# Altium schematic sheet Motor.SchDoc
size A3; SheetNumber: 2; SheetTotal: 5
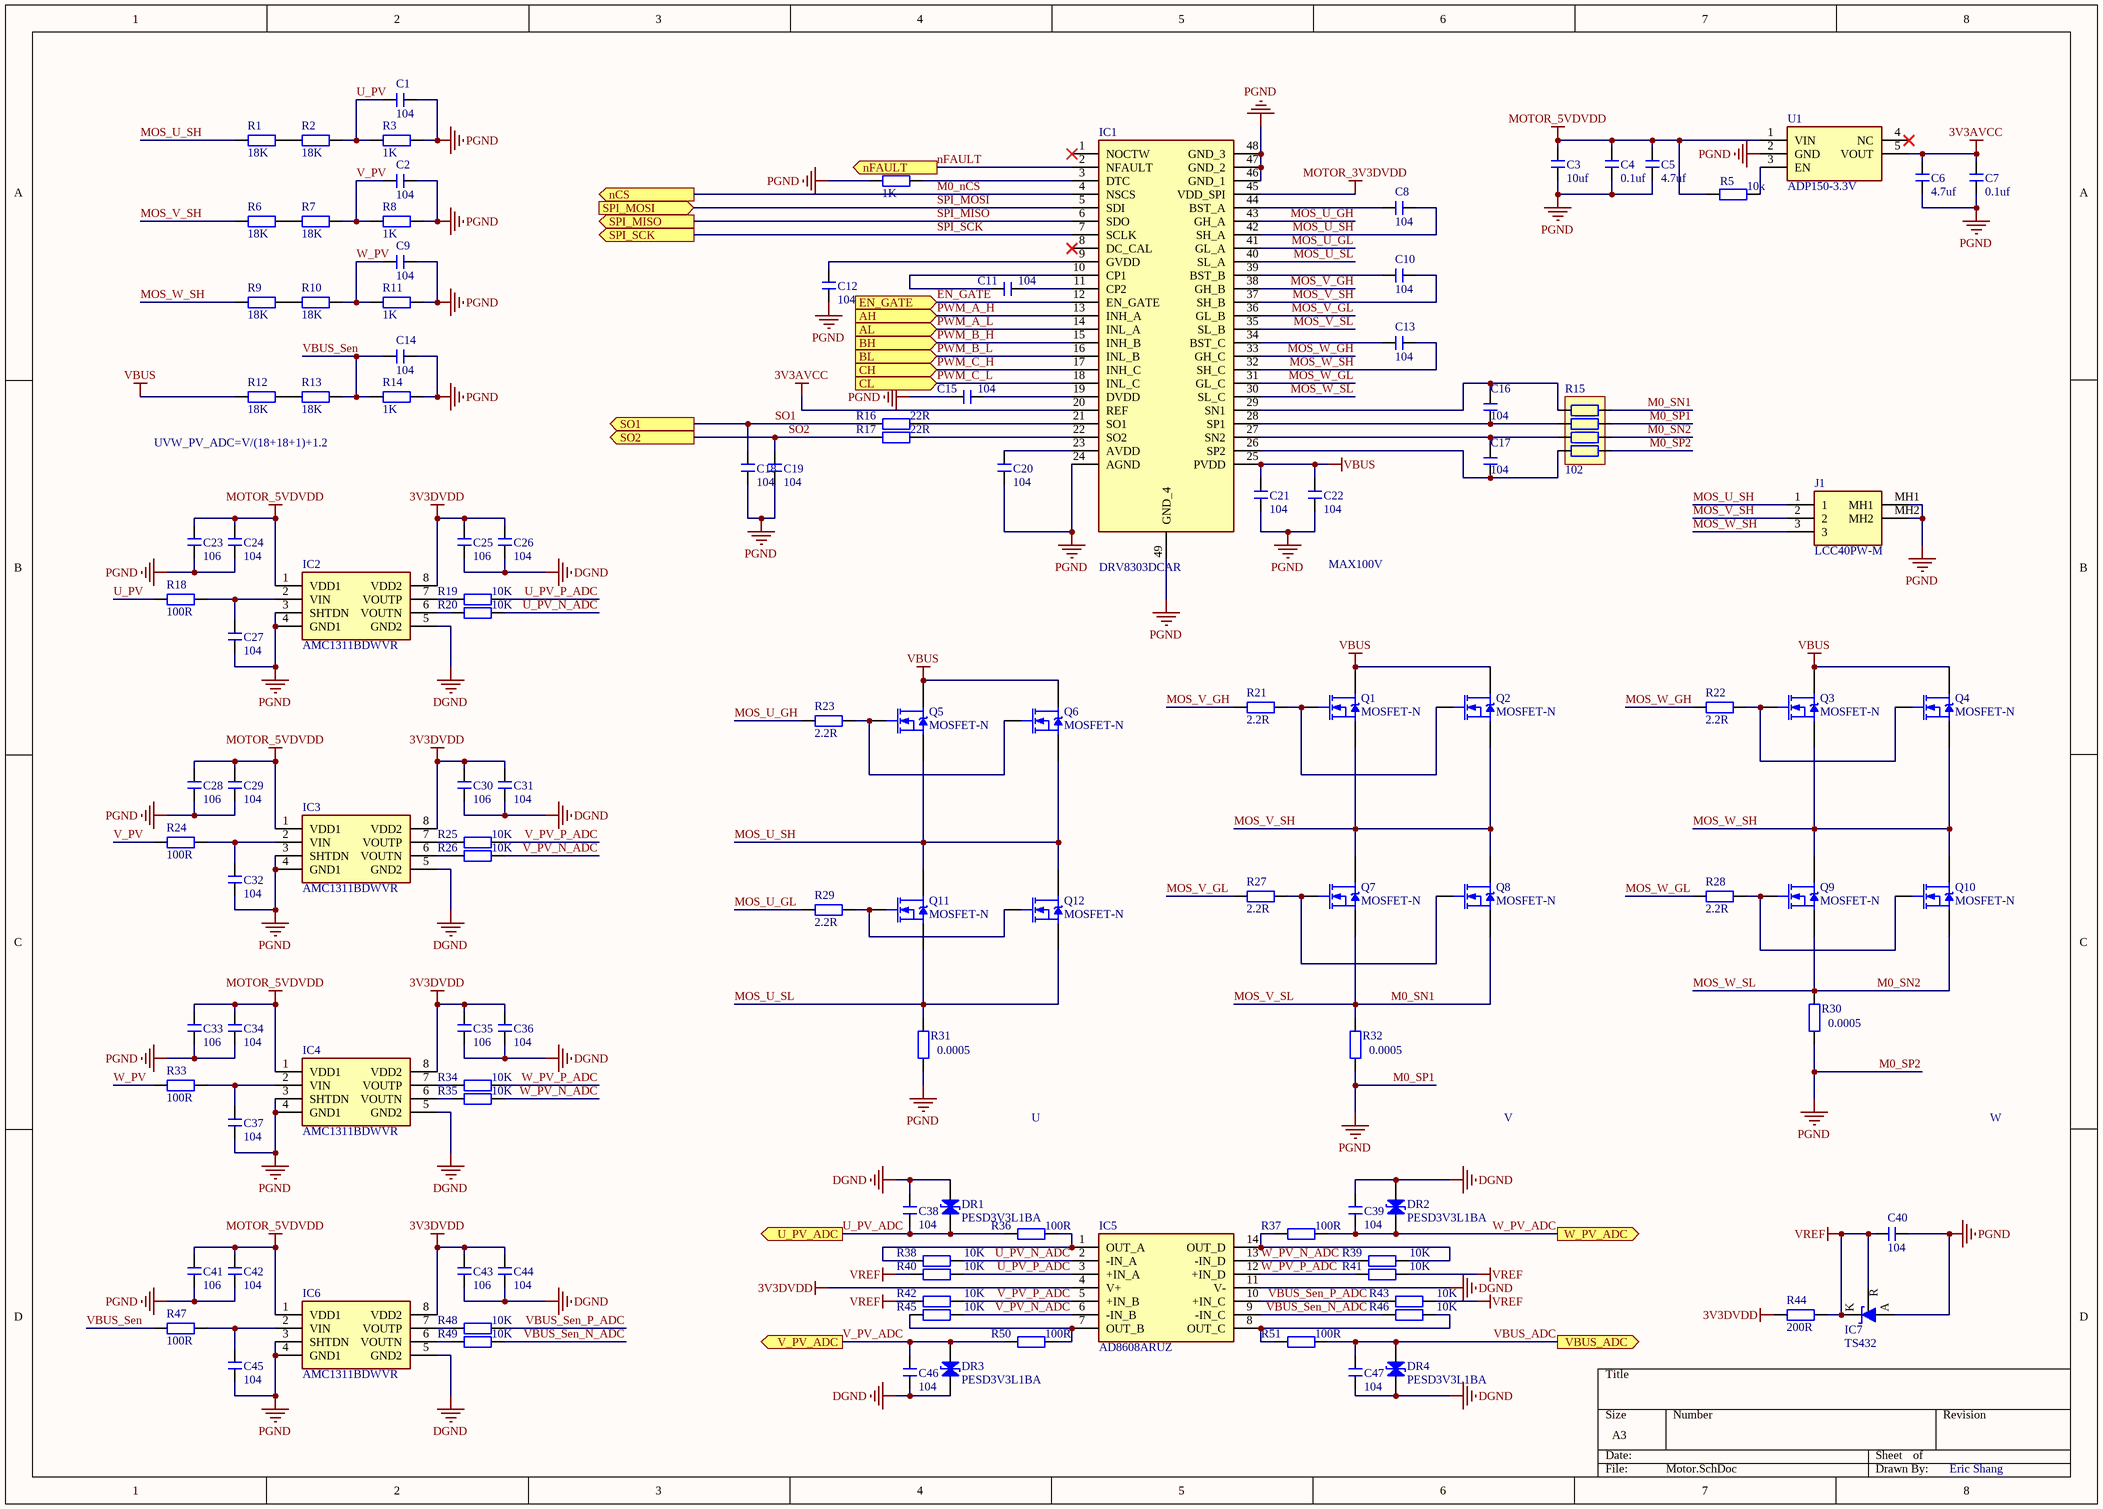
[diagram p0: Motor.SchDoc]

## Parts
C1  104  [C 0603_L]
C2  104  [C 0603_L]
C3  10uf  [C 0805_L]
C4  0.1uf  [C 0805_L]
C5  4.7uf  [C 0805_L]
C6  4.7uf  [C 0805_L]
C7  0.1uf  [C 0805_L]
C8  104  [C 0603_L]
C9  104  [C 0603_L]
C10  104  [C 0603_L]
C11  104  [C 0603_L]
C12  104  [C 0603_L]
C13  104  [C 0603_L]
C14  104  [C 0603_L]
C15  104  [C 0603_L]
C16  104  [C 0603_L]
C17  104  [C 0603_L]
C18  104  [C 0603_L]
C19  104  [C 0603_L]
C20  104  [C 0603_L]
C21  104  [C 0603_L]
C22  104  [C 0603_L]
C23  106  [C 0603_L]
C24  104  [C 0603_L]
C25  106  [C 0603_L]
C26  104  [C 0603_L]
C27  104  [C 0603_L]
C28  106  [C 0603_L]
C29  104  [C 0603_L]
C30  106  [C 0603_L]
C31  104  [C 0603_L]
C32  104  [C 0603_L]
C33  106  [C 0603_L]
C34  104  [C 0603_L]
C35  106  [C 0603_L]
C36  104  [C 0603_L]
C37  104  [C 0603_L]
C38  104  [C 0603_L]
C39  104  [C 0603_L]
C40  104  [C 0603_L]
C41  106  [C 0603_L]
C42  104  [C 0603_L]
C43  106  [C 0603_L]
C44  104  [C 0603_L]
C45  104  [C 0603_L]
C46  104  [C 0603_L]
C47  104  [C 0603_L]
DR1  PESD3V3L1BA  [DO-15]
DR2  PESD3V3L1BA  [DO-15]
DR3  PESD3V3L1BA  [DO-15]
DR4  PESD3V3L1BA  [DO-15]
IC1  DRV8303DCAR  [SOP50P810X120-49N]
IC2  AMC1311BDWVR  [SOIC127P1150X280-8N]
IC3  AMC1311BDWVR  [SOIC127P1150X280-8N]
IC4  AMC1311BDWVR  [SOIC127P1150X280-8N]
IC5  AD8608ARUZ  [SOP65P640X120-14N]
IC6  AMC1311BDWVR  [SOIC127P1150X280-8N]
IC7  TS432  [SOT23-3N]
J1  LCC40PW-M  [LCC40PWM]
Q1  MOSFET-N  [TO263-3B]
Q2  MOSFET-N  [TO263-3B]
Q3  MOSFET-N  [TO263-3B]
Q4  MOSFET-N  [TO263-3B]
Q5  MOSFET-N  [TO263-3B]
Q6  MOSFET-N  [TO263-3B]
Q7  MOSFET-N  [TO263-3B]
Q8  MOSFET-N  [TO263-3B]
Q9  MOSFET-N  [TO263-3B]
Q10  MOSFET-N  [TO263-3B]
Q11  MOSFET-N  [TO263-3B]
Q12  MOSFET-N  [TO263-3B]
R1  18K  [R 0603_L]
R2  18K  [R 0603_L]
R3  1K  [R 0603_L]
R4  1K  [R 0603_L]
R5  10k  [0805_R]
R6  18K  [R 0603_L]
R7  18K  [R 0603_L]
R8  1K  [R 0603_L]
R9  18K  [R 0603_L]
R10  18K  [R 0603_L]
R11  1K  [R 0603_L]
R12  18K  [R 0603_L]
R13  18K  [R 0603_L]
R14  1K  [R 0603_L]
R15  102  [RCA-8P4R-0603]
R16  22R  [R 0603_L]
R17  22R  [R 0603_L]
R18  100R  [R 0603_L]
R19  10K  [R 0603_L]
R20  10K  [R 0603_L]
R21  2.2R  [R 0603_L]
R22  2.2R  [R 0603_L]
R23  2.2R  [R 0603_L]
R24  100R  [R 0603_L]
R25  10K  [R 0603_L]
R26  10K  [R 0603_L]
R27  2.2R  [R 0603_L]
R28  2.2R  [R 0603_L]
R29  2.2R  [R 0603_L]
R30  0.0005  [R 2512_M]
R31  0.0005  [R 2512_M]
R32  0.0005  [R 2512_M]
R33  100R  [R 0603_L]
R34  10K  [R 0603_L]
R35  10K  [R 0603_L]
R36  100R  [R 0603_L]
R37  100R  [R 0603_L]
R38  10K  [R 0603_L]
R39  10K  [R 0603_L]
R40  10K  [R 0603_L]
R41  10K  [R 0603_L]
R42  10K  [R 0603_L]
R43  10K  [R 0603_L]
R44  200R  [R 0603_L]
R45  10K  [R 0603_L]
R46  10K  [R 0603_L]
R47  100R  [R 0603_L]
R48  10K  [R 0603_L]
R49  10K  [R 0603_L]
R50  100R  [R 0603_L]
R51  100R  [R 0603_L]
U1  ADP150-3.3V

## Ports
AH (in), AL (in), BH (in), BL (in), CH (in), CL (in), EN_GATE (in), nCS (out), nFAULT (out), SO1 (out), SO2 (out), SPI_MISO (out), SPI_MOSI (in), SPI_SCK (out), U_PV_ADC (out), V_PV_ADC (out), VBUS_ADC (out), W_PV_ADC (out)

## Nets
3V3AVCC: C6.2 C7.2 IC1.20(REF) U1.5(VOUT)
3V3DVDD: C25.2 C26.2 C30.2 C31.2 C35.2 C36.2 C43.2 C44.2 IC2.8(VDD2) IC3.8(VDD2) IC4.8(VDD2) IC5.4(V+) IC6.8(VDD2) R44.1
DGND: C25.1 C26.1 C30.1 C31.1 C35.1 C36.1 C38.1 C39.1 C43.1 C44.1 C46.2 C47.2 DR1.1(A) DR2.1(A) DR3.2(K) DR4.2(K) IC2.5(GND2) IC3.5(GND2) IC4.5(GND2) IC5.11(V-) IC6.5(GND2)
M0_SP1: C1.2 C2.2 C3.1 C4.1 C5.1 C6.1 C7.1 C9.2 C12.1 C14.2 C15.1 C18.2 C19.2 C20.2 C21.2 C22.2 C23.1 C24.1 C27.1 C28.1 C29.1 C32.1 C33.1 C34.1 C37.1 C40.1 C41.1 C42.1 C45.1 IC1.24(AGND) IC1.46(GND_1) IC1.47(GND_2) IC1.48(GND_3) IC1.49(GND_4) IC2.3(SHTDN) IC2.4(GND1) IC3.3(SHTDN) IC3.4(GND1) IC4.3(SHTDN) IC4.4(GND1) IC6.3(SHTDN) IC6.4(GND1) IC7.3(A) J1.MH1 J1.MH2 R3.2 R4.1 R8.2 R11.2 R14.2 R15.5 R15.7 R30.1 R31.1 R32.1 U1.2(GND)  [also labelled M0_SP2, PGND]
MOTOR_3V3DVDD: IC1.45(VDD_SPI)
MOTOR_5VDVDD: C3.2 C4.2 C5.2 C23.2 C24.2 C28.2 C29.2 C33.2 C34.2 C41.2 C42.2 IC2.1(VDD1) IC3.1(VDD1) IC4.1(VDD1) IC6.1(VDD1) R5.1 U1.1(VIN)
VBUS: C21.1 C22.1 IC1.25(PVDD) Q1.2(D) Q2.2(D) Q3.2(D) Q4.2(D) Q5.2(D) Q6.2(D) R12.1
VREF: C40.2 IC7.1(R) IC7.2(K) R40.2 R41.1 R42.1 R43.2 R44.2
EN_GATE: IC1.12(EN_GATE) ; port EN_GATE
M0_nCS: IC1.4(NSCS) ; port nCS
M0_SN1: IC1.35(SL_B) Q7.3(S) Q8.3(S) R15.8 R32.2  [also labelled MOS_V_SL]
M0_SN2: IC1.30(SL_C) Q9.3(S) Q10.3(S) R15.6 R30.2  [also labelled MOS_W_SL]
MOS_U_GH: IC1.43(GH_A) R23.1
MOS_U_GL: IC1.41(GL_A) R29.1
MOS_U_SH: C8.2 IC1.42(SH_A) J1.1 Q5.3(S) Q6.3(S) Q11.2(D) Q12.2(D) R1.1
MOS_U_SL: IC1.40(SL_A) Q11.3(S) Q12.3(S) R31.2
MOS_V_GH: IC1.38(GH_B) R21.1
MOS_V_GL: IC1.36(GL_B) R27.1
MOS_V_SH: C10.2 IC1.37(SH_B) J1.2 Q1.3(S) Q2.3(S) Q7.2(D) Q8.2(D) R6.1
MOS_W_GH: IC1.33(GH_C) R22.1
MOS_W_GL: IC1.31(GL_C) R28.1
MOS_W_SH: C13.2 IC1.32(SH_C) J1.3 Q3.3(S) Q4.3(S) Q9.2(D) Q10.2(D) R9.1
nFAULT: IC1.2(NFAULT) ; port nFAULT
PWM_A_H: IC1.13(INH_A) ; port AH
PWM_A_L: IC1.14(INL_A) ; port AL
PWM_B_H: IC1.15(INH_B) ; port BH
PWM_B_L: IC1.16(INL_B) ; port BL
PWM_C_H: IC1.17(INH_C) ; port CH
PWM_C_L: IC1.18(INL_C) ; port CL
SO1: C18.1 R16.1 ; port SO1
SO2: C19.1 R17.1 ; port SO2
SPI_MISO: IC1.6(SDO) ; port SPI_MISO
SPI_MOSI: IC1.5(SDI) ; port SPI_MOSI
SPI_SCK: IC1.7(SCLK) ; port SPI_SCK
U_PV: C1.1 R2.2 R3.1 R18.1
U_PV_ADC: C38.2 DR1.2(K) R36.2 ; port U_PV_ADC
U_PV_N_ADC: IC5.2(-IN_A) R20.1 R38.2
U_PV_P_ADC: IC5.3(+IN_A) R19.1 R40.1
V_PV: C2.1 R7.2 R8.1 R24.1
V_PV_ADC: C46.1 DR3.1(A) R50.2 ; port V_PV_ADC
V_PV_N_ADC: IC5.6(-IN_B) R26.1 R45.1
V_PV_P_ADC: IC5.5(+IN_B) R25.1 R42.2
VBUS_ADC: C47.1 DR4.1(A) R51.1 ; port VBUS_ADC
VBUS_Sen: C14.1 R13.2 R14.1 R47.1
VBUS_Sen_N_ADC: IC5.9(-IN_C) R46.2 R49.1
VBUS_Sen_P_ADC: IC5.10(+IN_C) R43.1 R48.1
W_PV: C9.1 R10.2 R11.1 R33.1
W_PV_ADC: C39.2 DR2.2(K) R37.1 ; port W_PV_ADC
W_PV_N_ADC: IC5.13(-IN_D) R35.1 R39.1
W_PV_P_ADC: IC5.12(+IN_D) R34.1 R41.2
NetC8_1: C8.1 IC1.44(BST_A)
NetC10_1: C10.1 IC1.39(BST_B)
NetC11_1: C11.1 IC1.10(CP1)
NetC11_2: C11.2 IC1.11(CP2)
NetC12_2: C12.2 IC1.9(GVDD)
NetC13_1: C13.1 IC1.34(BST_C)
NetC15_2: C15.2 IC1.19(DVDD)
NetC16_1: C16.1 IC1.28(SP1) R15.2
NetC16_2: C16.2 IC1.29(SN1) R15.1
NetC17_1: C17.1 IC1.26(SP2) R15.4
NetC17_2: C17.2 IC1.27(SN2) R15.3
NetC20_1: C20.1 IC1.23(AVDD)
NetC27_2: C27.2 IC2.2(VIN) R18.2
NetC32_2: C32.2 IC3.2(VIN) R24.2
NetC37_2: C37.2 IC4.2(VIN) R33.2
NetC45_2: C45.2 IC6.2(VIN) R47.2
NetIC1_3: IC1.3(DTC) R4.2
NetIC1_21: IC1.21(SO1) R16.2
NetIC1_22: IC1.22(SO2) R17.2
NetIC2_6: IC2.6(VOUTN) R20.2
NetIC2_7: IC2.7(VOUTP) R19.2
NetIC3_6: IC3.6(VOUTN) R26.2
NetIC3_7: IC3.7(VOUTP) R25.2
NetIC4_6: IC4.6(VOUTN) R35.2
NetIC4_7: IC4.7(VOUTP) R34.2
NetIC5_1: IC5.1(OUT_A) R36.1 R38.1
NetIC5_7: IC5.7(OUT_B) R45.2 R50.1
NetIC5_8: IC5.8(OUT_C) R46.1 R51.2
NetIC5_14: IC5.14(OUT_D) R37.2 R39.2
NetIC6_6: IC6.6(VOUTN) R49.2
NetIC6_7: IC6.7(VOUTP) R48.2
NetQ1_1: Q1.1(G) Q2.1(G) R21.2
NetQ3_1: Q3.1(G) Q4.1(G) R22.2
NetQ5_1: Q5.1(G) Q6.1(G) R23.2
NetQ7_1: Q7.1(G) Q8.1(G) R27.2
NetQ9_1: Q9.1(G) Q10.1(G) R28.2
NetQ11_1: Q11.1(G) Q12.1(G) R29.2
NetR1_2: R1.2 R2.1
NetR5_2: R5.2 U1.3(EN)
NetR6_2: R6.2 R7.1
NetR9_2: R9.2 R10.1
NetR12_2: R12.2 R13.1

Not connected (* = marked no-connect by the designer): IC1 1(NOCTW)* 8(DC_CAL)*; U1 4(NC)*

## Notes on the sheet
- UVW_PV_ADC=V/(18+18+1)+1.2
- MAX100V
- U
- V
- W
- Eric Shang

## Library data of the parts
C1-C47 = C: 贴片电容; BOM名称: 无极性贴片电容
DR1-DR4 = DR: 瞬态电压抑制二极管; 版权归属: 封装库来自淘宝 ID：黄晶宝石; BOM名称: 瞬态电压抑制二极管; 学习资源: https://shop463601444.taobao.com
IC1 = DRV8303DCAR: Integrated Circuit; Manufacturer_Name: Texas Instruments; Datasheet Link: http://www.ti.com/lit/gpn/drv8303; Height: 1.2mm; Manufacturer_Part_Number: DRV8303DCAR; Mouser Part Number: 595-DRV8303DCAR; Mouser Price/Stock: https://www.mouser.co.uk/ProductDetail/Texas-Instruments/DRV8303DCAR?qs=igp4D3uu33JOvU%2FdrzSIMA%3D%3D; Arrow Part Number: DRV8303DCAR; Arrow Price/Stock: https://www.arrow.com/en/products/drv8303dcar/texas-instruments
IC2-IC4 IC6 = AMC1311BDWVR: Integrated Circuit; Manufacturer_Name: Texas Instruments; Datasheet Link: http://www.ti.com/lit/gpn/amc1311; Height: 2.8mm; Manufacturer_Part_Number: AMC1311BDWVR; Mouser Part Number: 595-AMC1311BDWVR; Mouser Price/Stock: https://www.mouser.co.uk/ProductDetail/Texas-Instruments/AMC1311BDWVR?qs=W0yvOO0ixfFQekR98E4CkQ%3D%3D; Arrow Part Number: AMC1311BDWVR; Arrow Price/Stock: https://www.arrow.com/en/products/amc1311bdwvr/texas-instruments?region=nac
IC5 = AD8608ARUZ: Integrated Circuit; Manufacturer_Name: Analog Devices; Datasheet Link: http://www.analog.com/media/en/technical-documentation/data-sheets/AD8605_8606_8608.pdf; Height: 1.2mm; Manufacturer_Part_Number: AD8608ARUZ; Mouser Part Number: 584-AD8608ARUZ; Mouser Price/Stock: https://www.mouser.co.uk/ProductDetail/Analog-Devices/AD8608ARUZ?qs=%2FtpEQrCGXCxg3nNHNwXPVQ%3D%3D; Arrow Part Number: AD8608ARUZ; Arrow Price/Stock: https://www.arrow.com/en/products/ad8608aruz/analog-devices?region=europe
IC7 = TL431_SMD: 可调基准稳压芯片; 版权归属: 封装库来自淘宝 ID：黄晶宝石; BOM名称: 可调基准稳压芯片; 学习资源: https://shop463601444.taobao.com
J1 = LCC40PW-M: Connector; Manufacturer_Name: Amass; Datasheet Link: https://www.li-force.ru/uploads/entity/lcc40pw-m-2023v2.pdf; Height: 13.65mm; Manufacturer_Part_Number: LCC40PW-M
Q1-Q12 = MOSFET-N: N-Channel MOSFET; PackageDocument: 1995/1996; Published: 8-Jun-2000; LatestRevisionDate: 17-Jul-2002; LatestRevisionNote: Re-released for DXP Platform.; PackageReference: E3; Publisher: Altium Limited
R1-R4 R6-R14 R16-R51 = R: 贴片电阻; BOM名称: 贴片电阻
R5 = 0805 电阻: 贴片电阻 0805 电阻; ComponentLink1Description: 供应商链接; ComponentLink1URL: http://www.szlcsc.com/product/details_18165.html; Package: 0805; Supplier: LC; SuppliersPartNumber: C17477
R15 = R-8P4R: 贴片排阻; BOM名称: 贴片网络排阻; 版权归属: 封装库来自淘宝 ID：黄晶宝石; 联系售后: https://shop463601444.taobao.com
U1 = ADP150: IOVDD needs 1.8V